# EAGLE design Resistor_Phantom (EAGLE 7.2.0)
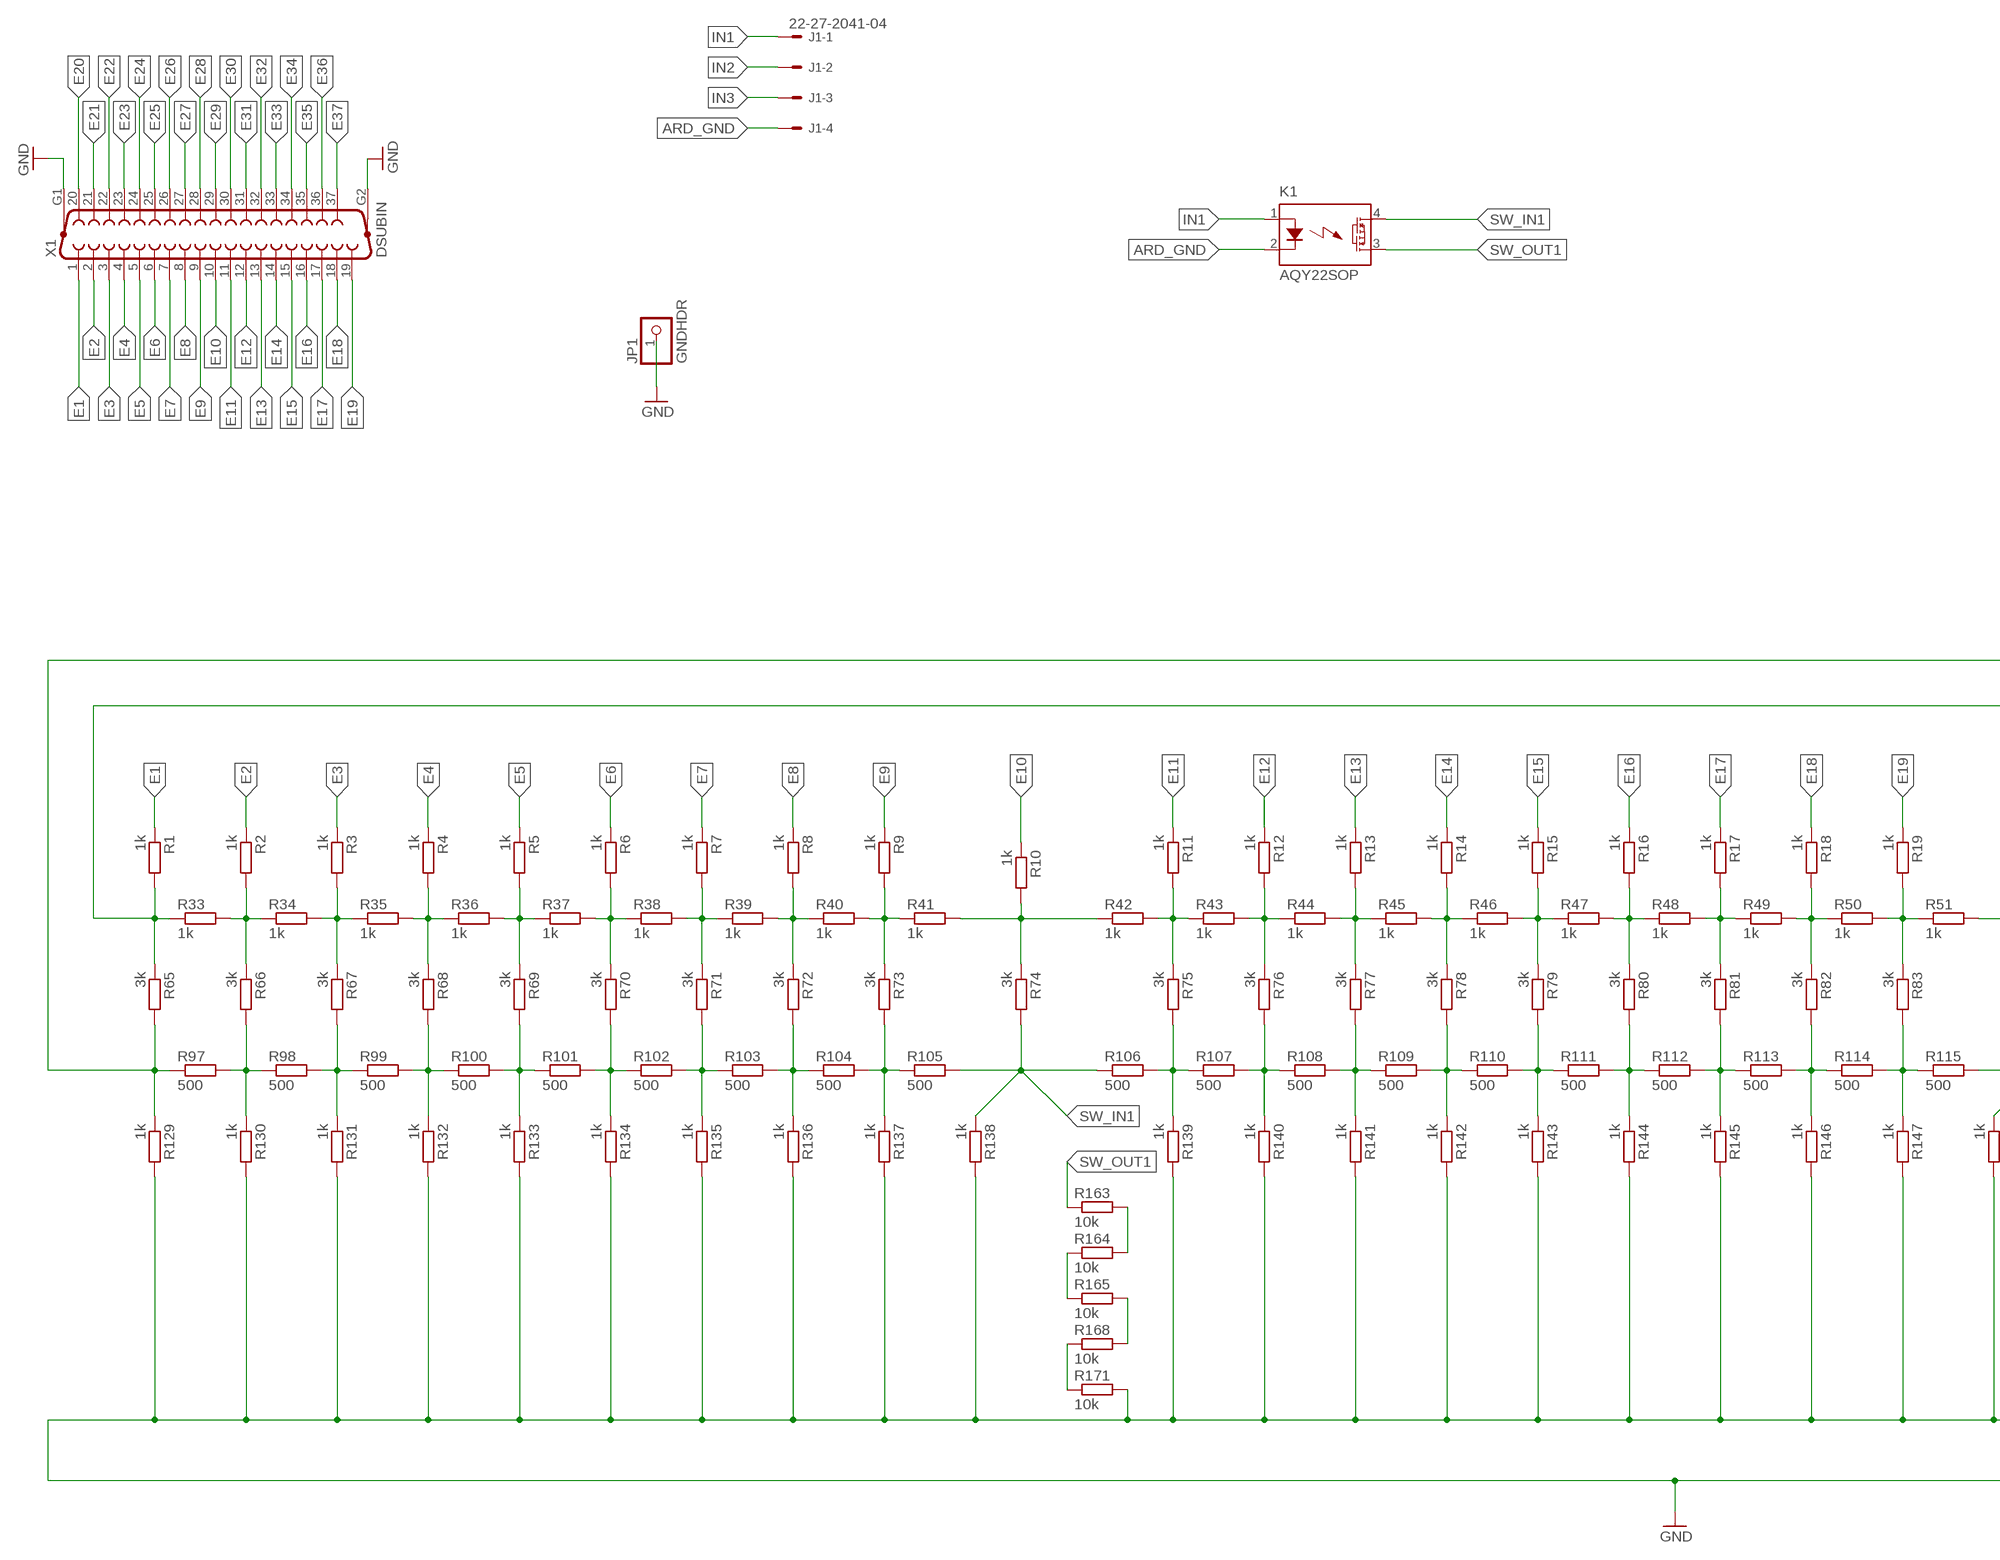
[diagram p0: schematic, sheet 1, part 1 of 2]
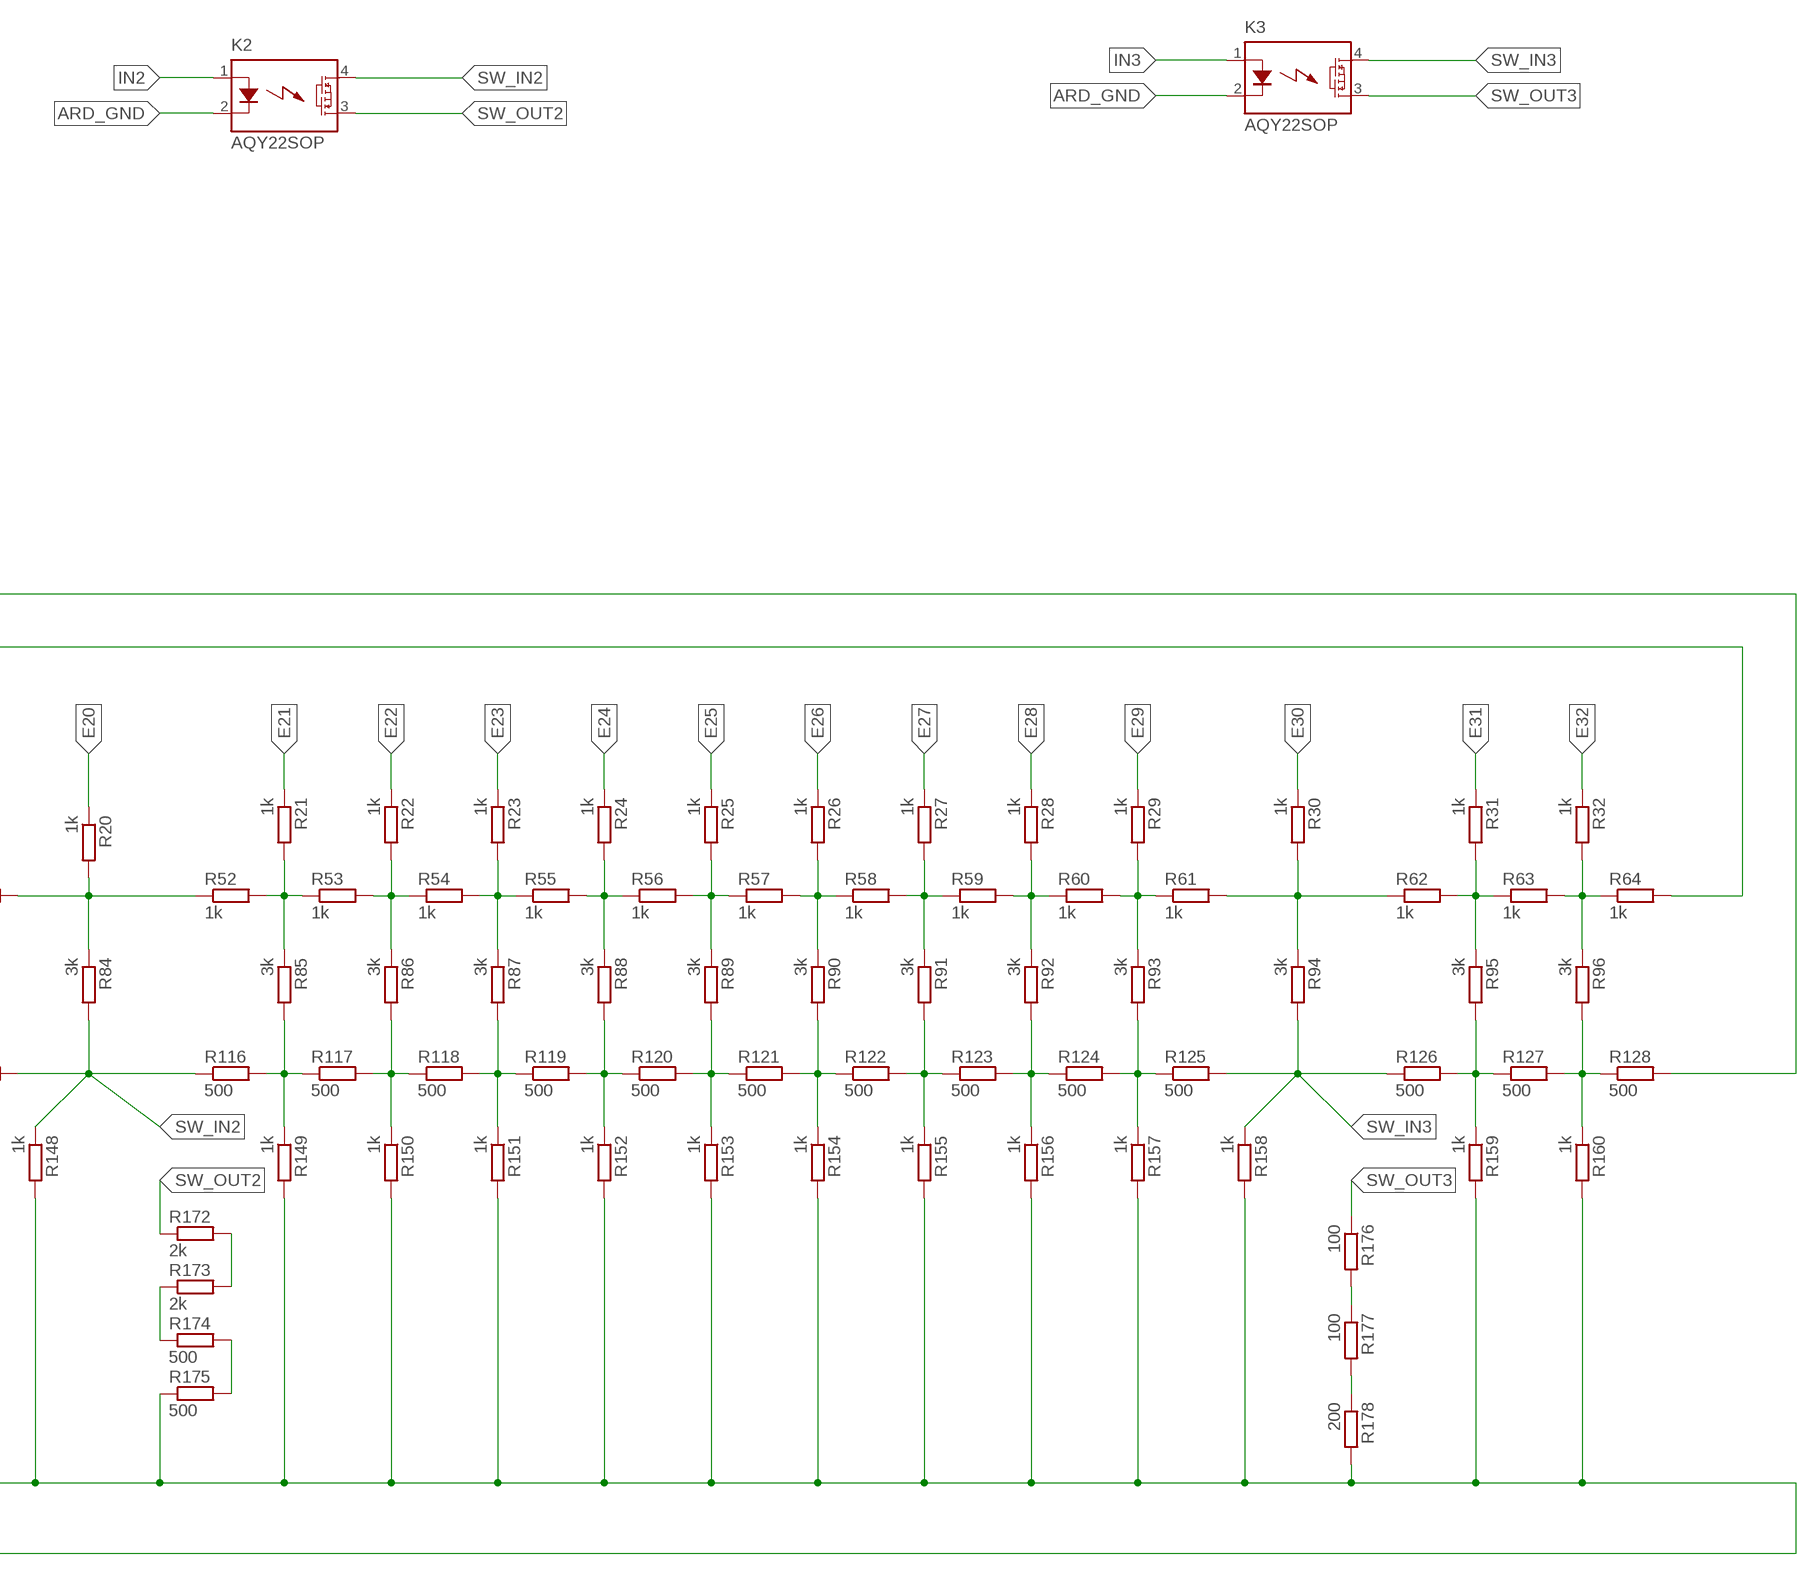
[diagram p1: schematic, sheet 1, part 2 of 2]

## Parts
J1  22-27-2041-04  [6410-04]
JP1  GNDHDR  PINHD-1X1  [1X01]
K1  AQY22SOP  [SOP04]
K2  AQY22SOP  [SOP04]
K3  AQY22SOP  [SOP04]
R1  1k  R-EU_R0402  [R0402]
R2  1k  R-EU_R0402  [R0402]
R3  1k  R-EU_R0402  [R0402]
R4  1k  R-EU_R0402  [R0402]
R5  1k  R-EU_R0402  [R0402]
R6  1k  R-EU_R0402  [R0402]
R7  1k  R-EU_R0402  [R0402]
R8  1k  R-EU_R0402  [R0402]
R9  1k  R-EU_R0402  [R0402]
R10  1k  R-EU_R0402  [R0402]
R11  1k  R-EU_R0402  [R0402]
R12  1k  R-EU_R0402  [R0402]
R13  1k  R-EU_R0402  [R0402]
R14  1k  R-EU_R0402  [R0402]
R15  1k  R-EU_R0402  [R0402]
R16  1k  R-EU_R0402  [R0402]
R17  1k  R-EU_R0402  [R0402]
R18  1k  R-EU_R0402  [R0402]
R19  1k  R-EU_R0402  [R0402]
R20  1k  R-EU_R0402  [R0402]
R21  1k  R-EU_R0402  [R0402]
R22  1k  R-EU_R0402  [R0402]
R23  1k  R-EU_R0402  [R0402]
R24  1k  R-EU_R0402  [R0402]
R25  1k  R-EU_R0402  [R0402]
R26  1k  R-EU_R0402  [R0402]
R27  1k  R-EU_R0402  [R0402]
R28  1k  R-EU_R0402  [R0402]
R29  1k  R-EU_R0402  [R0402]
R30  1k  R-EU_R0402  [R0402]
R31  1k  R-EU_R0402  [R0402]
R32  1k  R-EU_R0402  [R0402]
R33  1k  R-EU_R0402  [R0402]
R34  1k  R-EU_R0402  [R0402]
R35  1k  R-EU_R0402  [R0402]
R36  1k  R-EU_R0402  [R0402]
R37  1k  R-EU_R0402  [R0402]
R38  1k  R-EU_R0402  [R0402]
R39  1k  R-EU_R0402  [R0402]
R40  1k  R-EU_R0402  [R0402]
R41  1k  R-EU_R0402  [R0402]
R42  1k  R-EU_R0402  [R0402]
R43  1k  R-EU_R0402  [R0402]
R44  1k  R-EU_R0402  [R0402]
R45  1k  R-EU_R0402  [R0402]
R46  1k  R-EU_R0402  [R0402]
R47  1k  R-EU_R0402  [R0402]
R48  1k  R-EU_R0402  [R0402]
R49  1k  R-EU_R0402  [R0402]
R50  1k  R-EU_R0402  [R0402]
R51  1k  R-EU_R0402  [R0402]
R52  1k  R-EU_R0402  [R0402]
R53  1k  R-EU_R0402  [R0402]
R54  1k  R-EU_R0402  [R0402]
R55  1k  R-EU_R0402  [R0402]
R56  1k  R-EU_R0402  [R0402]
R57  1k  R-EU_R0402  [R0402]
R58  1k  R-EU_R0402  [R0402]
R59  1k  R-EU_R0402  [R0402]
R60  1k  R-EU_R0402  [R0402]
R61  1k  R-EU_R0402  [R0402]
R62  1k  R-EU_R0402  [R0402]
R63  1k  R-EU_R0402  [R0402]
R64  1k  R-EU_R0402  [R0402]
R65  3k  R-EU_R0402  [R0402]
R66  3k  R-EU_R0402  [R0402]
R67  3k  R-EU_R0402  [R0402]
R68  3k  R-EU_R0402  [R0402]
R69  3k  R-EU_R0402  [R0402]
R70  3k  R-EU_R0402  [R0402]
R71  3k  R-EU_R0402  [R0402]
R72  3k  R-EU_R0402  [R0402]
R73  3k  R-EU_R0402  [R0402]
R74  3k  R-EU_R0402  [R0402]
R75  3k  R-EU_R0402  [R0402]
R76  3k  R-EU_R0402  [R0402]
R77  3k  R-EU_R0402  [R0402]
R78  3k  R-EU_R0402  [R0402]
R79  3k  R-EU_R0402  [R0402]
R80  3k  R-EU_R0402  [R0402]
R81  3k  R-EU_R0402  [R0402]
R82  3k  R-EU_R0402  [R0402]
R83  3k  R-EU_R0402  [R0402]
R84  3k  R-EU_R0402  [R0402]
R85  3k  R-EU_R0402  [R0402]
R86  3k  R-EU_R0402  [R0402]
R87  3k  R-EU_R0402  [R0402]
R88  3k  R-EU_R0402  [R0402]
R89  3k  R-EU_R0402  [R0402]
R90  3k  R-EU_R0402  [R0402]
R91  3k  R-EU_R0402  [R0402]
R92  3k  R-EU_R0402  [R0402]
R93  3k  R-EU_R0402  [R0402]
R94  3k  R-EU_R0402  [R0402]
R95  3k  R-EU_R0402  [R0402]
R96  3k  R-EU_R0402  [R0402]
R97  500  R-EU_R0402  [R0402]
R98  500  R-EU_R0402  [R0402]
R99  500  R-EU_R0402  [R0402]
R100  500  R-EU_R0402  [R0402]
R101  500  R-EU_R0402  [R0402]
R102  500  R-EU_R0402  [R0402]
R103  500  R-EU_R0402  [R0402]
R104  500  R-EU_R0402  [R0402]
R105  500  R-EU_R0402  [R0402]
R106  500  R-EU_R0402  [R0402]
R107  500  R-EU_R0402  [R0402]
R108  500  R-EU_R0402  [R0402]
R109  500  R-EU_R0402  [R0402]
R110  500  R-EU_R0402  [R0402]
R111  500  R-EU_R0402  [R0402]
R112  500  R-EU_R0402  [R0402]
R113  500  R-EU_R0402  [R0402]
R114  500  R-EU_R0402  [R0402]
R115  500  R-EU_R0402  [R0402]
R116  500  R-EU_R0402  [R0402]
R117  500  R-EU_R0402  [R0402]
R118  500  R-EU_R0402  [R0402]
R119  500  R-EU_R0402  [R0402]
R120  500  R-EU_R0402  [R0402]
R121  500  R-EU_R0402  [R0402]
R122  500  R-EU_R0402  [R0402]
R123  500  R-EU_R0402  [R0402]
R124  500  R-EU_R0402  [R0402]
R125  500  R-EU_R0402  [R0402]
R126  500  R-EU_R0402  [R0402]
R127  500  R-EU_R0402  [R0402]
R128  500  R-EU_R0402  [R0402]
R129  1k  R-EU_R0402  [R0402]
R130  1k  R-EU_R0402  [R0402]
R131  1k  R-EU_R0402  [R0402]
R132  1k  R-EU_R0402  [R0402]
R133  1k  R-EU_R0402  [R0402]
R134  1k  R-EU_R0402  [R0402]
R135  1k  R-EU_R0402  [R0402]
R136  1k  R-EU_R0402  [R0402]
R137  1k  R-EU_R0402  [R0402]
R138  1k  R-EU_R0402  [R0402]
R139  1k  R-EU_R0402  [R0402]
R140  1k  R-EU_R0402  [R0402]
R141  1k  R-EU_R0402  [R0402]
R142  1k  R-EU_R0402  [R0402]
R143  1k  R-EU_R0402  [R0402]
R144  1k  R-EU_R0402  [R0402]
R145  1k  R-EU_R0402  [R0402]
R146  1k  R-EU_R0402  [R0402]
R147  1k  R-EU_R0402  [R0402]
R148  1k  R-EU_R0402  [R0402]
R149  1k  R-EU_R0402  [R0402]
R150  1k  R-EU_R0402  [R0402]
R151  1k  R-EU_R0402  [R0402]
R152  1k  R-EU_R0402  [R0402]
R153  1k  R-EU_R0402  [R0402]
R154  1k  R-EU_R0402  [R0402]
R155  1k  R-EU_R0402  [R0402]
R156  1k  R-EU_R0402  [R0402]
R157  1k  R-EU_R0402  [R0402]
R158  1k  R-EU_R0402  [R0402]
R159  1k  R-EU_R0402  [R0402]
R160  1k  R-EU_R0402  [R0402]
R163  10k  R-EU_R0402  [R0402]
R164  10k  R-EU_R0402  [R0402]
R165  10k  R-EU_R0402  [R0402]
R168  10k  R-EU_R0402  [R0402]
R171  10k  R-EU_R0402  [R0402]
R172  2k  R-EU_R0402  [R0402]
R173  2k  R-EU_R0402  [R0402]
R174  500  R-EU_R0402  [R0402]
R175  500  R-EU_R0402  [R0402]
R176  100  R-EU_R0402  [R0402]
R177  100  R-EU_R0402  [R0402]
R178  200  R-EU_R0402  [R0402]
X1  DSUBIN  F37VP  [F37VP]

## Nets
ARD_GND: J1.4 K1.2(K) K2.2(K) K3.2(K)
E1: R1.1 X1.1
E2: R2.1 X1.2
E3: R3.1 X1.3
E4: R4.1 X1.4
E5: R5.1 X1.5
E6: R6.1 X1.6
E7: R7.1 X1.7
E8: R8.1 X1.8
E9: R9.1 X1.9
E10: R10.1 X1.10
E11: R11.1 X1.11
E12: R12.1 X1.12
E13: R13.1 X1.13
E14: R14.1 X1.14
E15: R15.1 X1.15
E16: R16.1 X1.16
E17: R17.1 X1.17
E18: R18.1 X1.18
E19: R19.1 X1.19
E20: R20.1 X1.20
E21: R21.1 X1.21
E22: R22.1 X1.22
E23: R23.1 X1.23
E24: R24.1 X1.24
E25: R25.1 X1.25
E26: R26.1 X1.26
E27: R27.1 X1.27
E28: R28.1 X1.28
E29: R29.1 X1.29
E30: R30.1 X1.30
E31: R31.1 X1.31
E32: R32.1 X1.32
E33: X1.33
E34: X1.34
E35: X1.35
E36: X1.36
E37: X1.37
E38: R1.2 R33.1 R64.2 R65.1
E39: R2.2 R33.2 R34.1 R66.1
E40: R3.2 R34.2 R35.1 R67.1
E41: R4.2 R35.2 R36.1 R68.1
E42: R5.2 R36.2 R37.1 R69.1
E43: R6.2 R37.2 R38.1 R70.1
E44: R7.2 R38.2 R39.1 R71.1
E45: R8.2 R39.2 R40.1 R72.1
E46: R9.2 R40.2 R41.1 R73.1
E47: R10.2 R41.2 R42.1 R74.1
E48: R11.2 R42.2 R43.1 R75.1
E49: R12.2 R43.2 R44.1 R76.1
E50: R13.2 R44.2 R45.1 R77.1
E51: R14.2 R45.2 R46.1 R78.1
E52: R15.2 R46.2 R47.1 R79.1
E53: R16.2 R47.2 R48.1 R80.1
E54: R17.2 R48.2 R49.1 R81.1
E55: R18.2 R49.2 R50.1 R82.1
E56: R19.2 R50.2 R51.1 R83.1
E57: R20.2 R51.2 R52.1 R84.1
E58: R21.2 R52.2 R53.1 R85.1
E59: R22.2 R53.2 R54.1 R86.1
E60: R23.2 R54.2 R55.1 R87.1
E61: R24.2 R55.2 R56.1 R88.1
E63: R26.2 R57.2 R58.1 R90.1
E64: R27.2 R58.2 R59.1 R91.1
E65: R28.2 R59.2 R60.1 R92.1
E66: R29.2 R60.2 R61.1 R93.1
E67: R30.2 R61.2 R62.1 R94.1
E68: R31.2 R62.2 R63.1 R95.1
E69: R32.2 R63.2 R64.1 R96.1
GND: JP1.1 R129.2 R130.2 R131.2 R132.2 R133.2 R134.2 R135.2 R136.2 R137.2 R138.2 R139.2 R140.2 R141.2 R142.2 R143.2 R144.2 R145.2 R146.2 R147.2 R148.2 R149.2 R150.2 R151.2 R152.2 R153.2 R154.2 R155.2 R156.2 R157.2 R158.2 R159.2 R160.2 R171.2 R175.1 R178.2 X1.G1 X1.G2
IN1: J1.1 K1.1(A)
IN2: J1.2 K2.1(A)
IN3: J1.3 K3.1(A)
N$1: R25.2 R56.2 R57.1 R89.1
N$2: R65.2 R97.1 R128.2 R129.1
N$3: R66.2 R97.2 R98.1 R130.1
N$4: R67.2 R98.2 R99.1 R131.1
N$5: R68.2 R99.2 R100.1 R132.1
N$6: R69.2 R100.2 R101.1 R133.1
N$7: R70.2 R101.2 R102.1 R134.1
N$8: R71.2 R102.2 R103.1 R135.1
N$9: R72.2 R103.2 R104.1 R136.1
N$10: R73.2 R104.2 R105.1 R137.1
N$12: R75.2 R106.2 R107.1 R139.1
N$13: R76.2 R107.2 R108.1 R140.1
N$14: R77.2 R108.2 R109.1 R141.1
N$15: R78.2 R109.2 R110.1 R142.1
N$16: R79.2 R110.2 R111.1 R143.1
N$17: R80.2 R111.2 R112.1 R144.1
N$18: R81.2 R112.2 R113.1 R145.1
N$19: R82.2 R113.2 R114.1 R146.1
N$20: R83.2 R114.2 R115.1 R147.1
N$22: R85.2 R116.2 R117.1 R149.1
N$23: R86.2 R117.2 R118.1 R150.1
N$24: R87.2 R118.2 R119.1 R151.1
N$25: R88.2 R119.2 R120.1 R152.1
N$26: R89.2 R120.2 R121.1 R153.1
N$28: R90.2 R121.2 R122.1 R154.1
N$29: R91.2 R122.2 R123.1 R155.1
N$30: R92.2 R123.2 R124.1 R156.1
N$31: R93.2 R124.2 R125.1 R157.1
N$33: R95.2 R126.2 R127.1 R159.1
N$34: R96.2 R127.2 R128.1 R160.1
N$41: R163.2 R164.2
N$42: R164.1 R165.1
N$43: R165.2 R168.2
N$44: R168.1 R171.1
N$45: R172.2 R173.2
N$46: R173.1 R174.1
N$47: R174.2 R175.2
N$48: R176.2 R177.1
N$49: R177.2 R178.1
SW_IN1: K1.4(DS1) R74.2 R105.2 R106.1 R138.1
SW_IN2: K2.4(DS1) R84.2 R115.2 R116.1 R148.1
SW_IN3: K3.4(DS1) R94.2 R125.2 R126.1 R158.1
SW_OUT1: K1.3(DS2) R163.1
SW_OUT2: K2.3(DS2) R172.1
SW_OUT3: K3.3(DS2) R176.1

## Library data of the parts
J1 = con-molex:22-?-04: CONNECTOR wire to board 2.54 mm (.1 inch) pitch header; OC_FARNELL: unknown; OC_NEWARK: unknown
JP1 = pinhead:PINHD-1X1: PIN HEADER
K1-K3 = relay:AQY*: PhotoMOS Relay NAiS Source: http://www.panasonic-electric-works.com/catalogues/downloads/photomos/ds_x615_en_aqz10_20.pdf; OC_FARNELL: unknown; OC_NEWARK: unknown
R1-R160 R163-R165 R168 R171-R178 = rcl:R-EU_: RESISTOR, European symbol
X1 = con-subd:F37VP: SUB-D; OC_FARNELL: unknown; OC_NEWARK: unknown

## Board
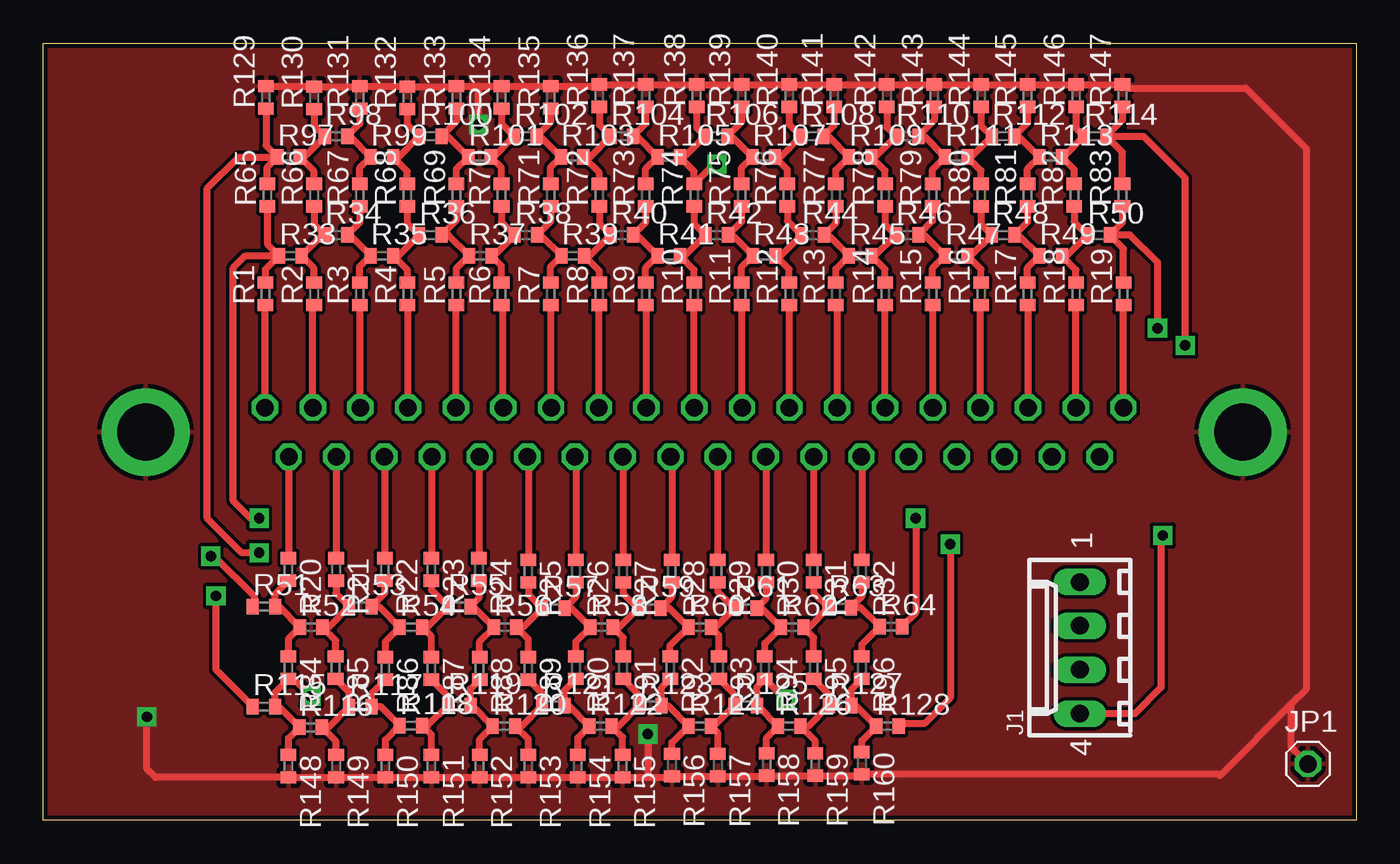
[diagram p2: board, top side]
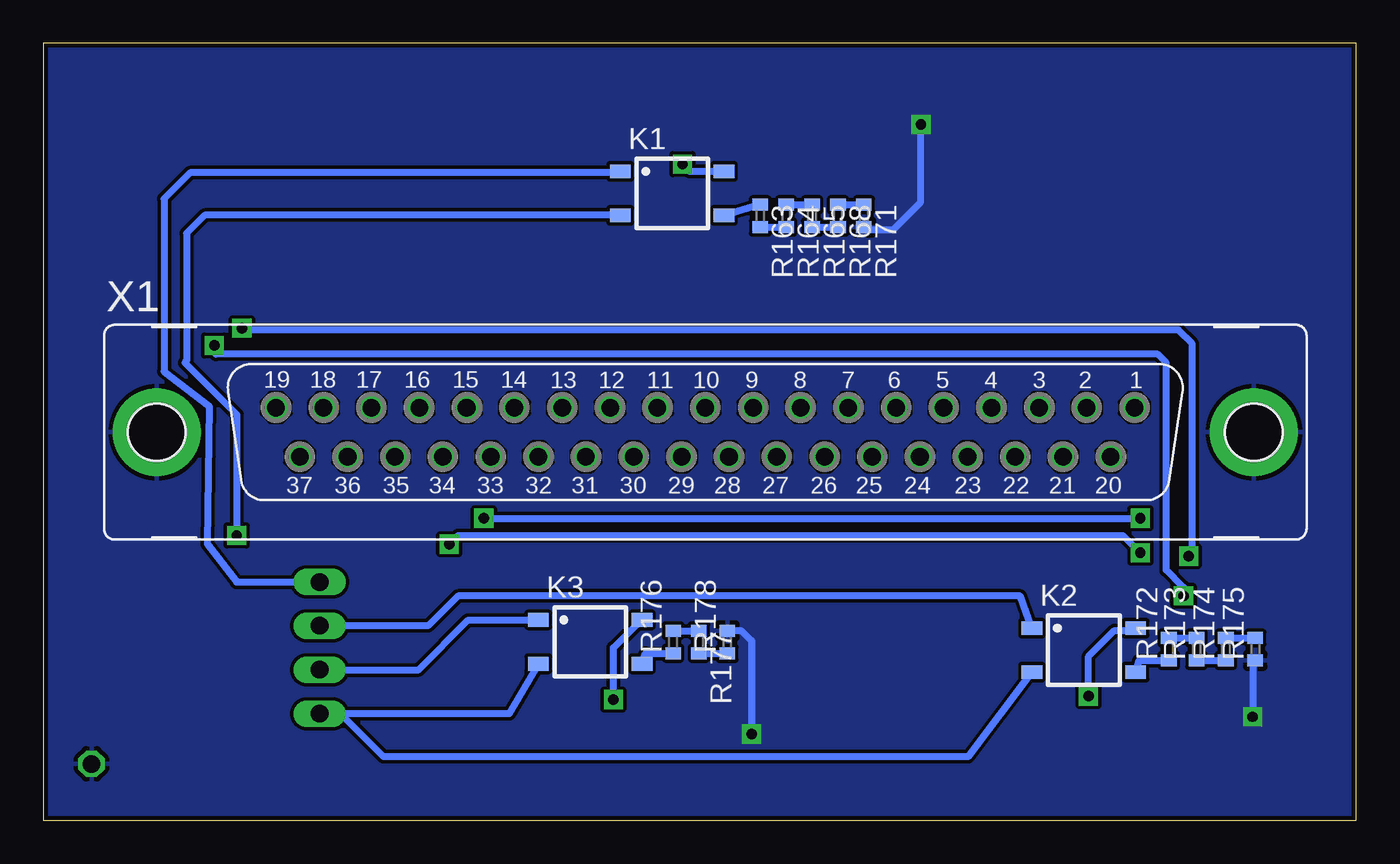
[diagram p3: board, bottom side, seen from below]

Size 76 x 45 mm. Coordinates in mm from the lower left corner, seen from the top.
Outline: 0,45 76,45 76,0 0,0 0,45
Copper layers (1*16): Top 0.035mm / dielectric 1.5mm / Bottom 0.035mm
Design rules "pcbtrain": minimum track width 0.2mm, minimum drill 0.4mm, track to track 0.2mm, track to pad 0.2mm, pad to pad 0.2mm, via to via 0.2mm, smd to smd 0mil, copper to edge 10mil, drill to drill 0.2mm, minimum pad ring 10mil, minimum via ring 10mil, stop-mask expansion 0.125mm, vias tented up to drill 0mil, thermal gap 10mil

### Footprints (pad centres in the part's own frame; a part is rotated, then mirrored left to right if it is on the bottom)
6410-04 = drill 1.016 long: 1 3.81,0; 2 1.27,0; 3 -1.27,0; 4 -3.81,0
1X01 = drill 1.016 octagon: 1 0,0
SOP04 = smd 0.8 x 1.2: 1 -1.27,-3; 2 1.27,-3; 3 1.27,3; 4 -1.27,3
R0402 = smd 0.7 x 0.9: 1 -0.65,0; 2 0.65,0
F37VP = drill 1.016 octagon: 1 24.841,1.422; 2 22.073,1.422; 3 19.329,1.422; 4 16.561,1.422; 5 13.792,1.422; 6 11.049,1.422; 7 8.28,1.422; 8 5.512,1.422; 9 2.769,1.422; 10 0,1.422; 11 -2.769,1.422; 12 -5.512,1.422; 13 -8.28,1.422; 14 -11.049,1.422; 15 -13.818,1.422; 16 -16.561,1.422; 17 -19.329,1.422; 18 -22.098,1.422; 19 -24.841,1.422; 20 23.47,-1.422; 21 20.701,-1.422; 22 17.932,-1.422; 23 15.189,-1.422; 24 12.421,-1.422; 25 9.652,-1.422; 26 6.909,-1.422; 27 4.14,-1.422; 28 1.372,-1.422; 29 -1.372,-1.422; 30 -4.14,-1.422; 31 -6.909,-1.422; 32 -9.677,-1.422; 33 -12.421,-1.422; 34 -15.189,-1.422; 35 -17.958,-1.422; 36 -20.701,-1.422; 37 -23.47,-1.422 | drill 3.302 pad 5.08: G1 -31.75,0; G2 31.75,0

### Placement (x,y rotation side)
J1  60,10 90 top
JP1  73.21,3.28 0 top
K1  39.6,36.31 270 bottom
K2  15.77,9.87 270 bottom
K3  44.34,10.35 270 bottom
R1  12.87,30.5 90 top
R2  15.68,30.5 90 top
R3  18.33,30.5 90 top
R4  21.09,30.5 90 top
R5  23.92,30.48 90 top
R6  26.53,30.48 90 top
R7  29.38,30.48 90 top
R8  32.19,30.48 90 top
R9  34.87,30.48 90 top
R10  37.68,30.48 90 top
R11  40.42,30.48 90 top
R12  43.17,30.48 90 top
R13  45.88,30.48 90 top
R14  48.73,30.48 90 top
R15  51.47,30.48 90 top
R16  54.28,30.48 90 top
R17  56.97,30.48 90 top
R18  59.78,30.48 90 top
R19  62.52,30.48 90 top
R20  14.2,14.54 270 top
R21  16.95,14.54 270 top
R22  19.77,14.54 270 top
R23  22.47,14.54 270 top
R24  25.22,14.54 270 top
R25  28.08,14.44 270 top
R26  30.83,14.44 270 top
R27  33.56,14.44 270 top
R28  36.38,14.44 270 top
R29  39.04,14.44 270 top
R30  41.83,14.44 270 top
R31  44.59,14.44 270 top
R32  47.38,14.44 270 top
R33  14.31,32.69 0 top
R34  16.95,33.89 0 top
R35  19.6,32.69 0 top
R36  22.41,33.89 0 top
R37  25.29,32.69 0 top
R38  27.94,33.89 0 top
R39  30.65,32.69 0 top
R40  33.5,33.89 0 top
R41  36.21,32.69 0 top
R42  38.99,33.89 0 top
R43  41.73,32.69 0 top
R44  44.54,33.89 0 top
R45  47.29,32.69 0 top
R46  50,33.89 0 top
R47  52.85,32.69 0 top
R48  55.56,33.89 0 top
R49  58.3,32.69 0 top
R50  61.09,33.89 0 top
R51  12.78,12.39 0 top
R52  15.51,11.19 0 top
R53  18.36,12.39 0 top
R54  21.28,11.19 0 top
R55  24.08,12.39 0 top
R56  26.73,11.19 0 top
R57  29.52,12.29 0 top
R58  32.32,11.19 0 top
R59  35.07,12.29 0 top
R60  37.99,11.19 0 top
R61  40.65,12.29 0 top
R62  43.34,11.19 0 top
R63  46.1,12.33 0 top
R64  49.06,11.23 0 top
R65  12.97,36.2 90 top
R66  15.68,36.2 90 top
R67  18.33,36.2 90 top
R68  21.07,36.2 90 top
R69  23.92,36.2 90 top
R70  26.53,36.2 90 top
R71  29.38,36.2 90 top
R72  32.19,36.2 90 top
R73  34.87,36.2 90 top
R74  37.68,36.2 90 top
R75  40.42,36.2 90 top
R76  43.07,36.2 90 top
R77  45.88,36.2 90 top
R78  48.73,36.2 90 top
R79  51.47,36.2 90 top
R80  54.28,36.2 90 top
R81  56.97,36.2 90 top
R82  59.68,36.2 90 top
R83  62.46,36.2 90 top
R84  14.2,8.84 270 top
R85  16.93,8.84 270 top
R86  19.81,8.81 270 top
R87  22.47,8.81 270 top
R88  25.26,8.81 270 top
R89  28.08,8.81 270 top
R90  30.83,8.84 270 top
R91  33.56,8.84 270 top
R92  36.29,8.84 270 top
R93  39.11,8.84 270 top
R94  41.77,8.84 270 top
R95  44.59,8.84 270 top
R96  47.38,8.84 270 top
R97  14.21,38.41 0 top
R98  16.95,39.61 0 top
R99  19.6,38.41 0 top
R100  22.41,39.61 0 top
R101  25.26,38.41 0 top
R102  27.9,39.61 0 top
R103  30.61,38.41 0 top
R104  33.5,39.61 0 top
R105  36.21,38.41 0 top
R106  38.95,39.61 0 top
R107  41.7,38.41 0 top
R108  44.51,39.61 0 top
R109  47.29,38.41 0 top
R110  50,39.61 0 top
R111  52.85,38.41 0 top
R112  55.56,39.61 0 top
R113  58.3,38.41 0 top
R114  60.89,39.61 0 top
R115  12.78,6.6 0 top
R116  15.48,5.4 0 top
R117  18.36,6.6 0 top
R118  21.28,5.5 0 top
R119  24.08,6.66 0 top
R120  26.67,5.46 0 top
R121  29.52,6.66 0 top
R122  32.25,5.46 0 top
R123  35.15,6.66 0 top
R124  38,5.46 0 top
R125  40.66,6.66 0 top
R126  43.18,5.46 0 top
R127  46.13,6.66 0 top
R128  48.86,5.46 0 top
R129  12.9,41.86 90 top
R130  15.68,41.82 90 top
R131  18.33,41.86 90 top
R132  21.07,41.82 90 top
R133  23.92,41.86 90 top
R134  26.53,41.86 90 top
R135  29.38,41.86 90 top
R136  32.19,41.96 90 top
R137  34.87,41.96 90 top
R138  37.81,41.96 90 top
R139  40.42,41.96 90 top
R140  43.17,41.96 90 top
R141  45.78,41.96 90 top
R142  48.83,41.96 90 top
R143  51.57,41.96 90 top
R144  54.28,41.96 90 top
R145  56.97,41.96 90 top
R146  59.78,41.96 90 top
R147  62.46,41.96 90 top
R148  14.2,3.15 270 top
R149  16.95,3.15 270 top
R150  19.81,3.15 270 top
R151  22.47,3.15 270 top
R152  25.26,3.15 270 top
R153  28.08,3.15 270 top
R154  30.94,3.15 270 top
R155  33.54,3.15 270 top
R156  36.39,3.21 270 top
R157  39.05,3.21 270 top
R158  41.87,3.25 270 top
R159  44.69,3.25 270 top
R160  47.38,3.31 270 top
R163  34.5,35 270 bottom
R164  33,35 270 bottom
R165  31.5,35 270 bottom
R168  30,35 270 bottom
R171  28.5,35 270 bottom
R172  10.85,9.92 90 bottom
R173  9.25,9.92 90 bottom
R174  7.55,9.92 90 bottom
R175  5.85,9.92 90 bottom
R176  39.55,10.34 90 bottom
R177  38.05,10.34 270 bottom
R178  36.41,10.33 90 bottom
X1  37.68,22.48 0 bottom

### Tracks (layer width: path | path; a pad name or v marks a point on that pad's centre or on a via)
ARD_GND  (via drill 0.6)
  Top 0.406: v64.8,16.5 64.7,16.4 64.7,7.7 63.19,6.19 J1.4
  Bottom 0.406: K3.2 49.04,6.19 J1.4 58.79,6.19 56.3,3.7 22.48,3.7 K2.2 | v64.8,16.5 64.8,23.5 67.8,26.5 67.7,26.6 67.7,34 66.66,35.03 K1.2
E1
  Top 0.406: X1.1 12.84,29.82 R1.1
E2
  Top 0.406: X1.2 15.61,29.78 R2.1
E3
  Top 0.406: X1.3 18.35,29.83 R3.1
E4
  Top 0.406: X1.4 21.12,29.82 R4.1
E5
  Top 0.406: X1.5 23.89,29.8 R5.1
E6
  Top 0.406: X1.6 26.63,29.73 R6.1
E7
  Top 0.406: X1.7 29.4,29.81 R7.1
E8
  Top 0.406: X1.8 32.17,29.82 R8.1
E9
  Top 0.406: X1.9 34.91,29.79 R9.1
E10
  Top 0.406: X1.10 R10.1
E11
  Top 0.406: X1.11 40.45,29.81 R11.1
E12
  Top 0.406: X1.12 43.19,29.82 R12.1
E13
  Top 0.406: X1.13 45.96,29.76 R13.1
E14
  Top 0.406: X1.14 R14.1
E15
  Top 0.406: X1.15 51.5,29.81 R15.1
E16
  Top 0.406: X1.16 54.24,29.79 R16.1
E17
  Top 0.406: X1.17 57.01,29.79 R17.1
E18
  Top 0.406: X1.18 R18.1
E19
  Top 0.406: X1.19 R19.1
E20
  Top 0.406: X1.20 14.2,21.05 R20.1
E21
  Top 0.406: X1.21 16.95,21.04 R21.1
E22
  Top 0.406: X1.22 19.77,21.03 R22.1
E23
  Top 0.406: X1.23 22.47,21.04 R23.1
E24
  Top 0.406: X1.24 25.22,21.02 R24.1
E25
  Top 0.406: X1.25 28.08,21.01 R25.1
E26
  Top 0.406: X1.26 30.83,20.99 R26.1
E27
  Top 0.406: X1.27 33.56,21.03 R27.1
E28
  Top 0.406: X1.28 36.38,20.98 R28.1
E29
  Top 0.406: X1.29 39.04,21.05 R29.1
E30
  Top 0.406: X1.30 41.83,21.05 R30.1
E31
  Top 0.406: X1.31 R31.1
E32
  Top 0.406: X1.32 47.38,21.03 R32.1
E38  (via drill 0.6)
  Top 0.406: v12.5,17.5 12,17.5 11,18.5 11,32 11.7,32.7 R33.1 | R1.2 12.87,31.91 R33.1 | R65.1 12.97,33.38 R33.1 | v50.5,17.5 50.5,12.01 R64.2
  Bottom 0.406: v50.5,17.5 v12.5,17.5
E39
  Top 0.406: R2.2 15.68,31.97 R33.2 16.16,33.89 R34.1 15.68,34.52 R66.1
E40
  Top 0.406: R3.2 18.33,32.07 R35.1 17.75,33.89 R34.2 18.33,34.62 R67.1
E41
  Top 0.406: R4.2 21.09,31.86 R35.2 20.56,32.69 R36.1 21.07,34.58 R68.1
E42
  Top 0.406: R5.2 23.92,31.97 R37.1 23.44,33.89 R36.2 23.92,34.75 R69.1
E43
  Top 0.406: R6.2 26.53,32.11 R37.2 26.09,32.69 R38.1 26.53,34.65 R70.1
E44
  Top 0.406: R7.2 29.38,32.07 R39.1 28.8,33.89 R38.2 29.38,34.68 R71.1
E45
  Top 0.406: R8.2 32.19,31.81 R39.2 31.64,32.69 R40.1 32.19,34.55 R72.1
E46
  Top 0.406: R9.2 34.87,32.01 R41.1 34.35,33.89 R40.2 34.87,34.62 R73.1
E47
  Top 0.406: R10.2 37.68,31.87 R41.2 37.14,32.69 R42.1 37.68,34.55 R74.1
E48
  Top 0.406: R11.2 40.42,32.03 R43.1 39.88,33.89 R42.2 40.42,34.68 R75.1
E49
  Top 0.406: R12.2 43.17,31.91 R43.2 42.69,32.69 R44.1 43.07,34.72 R76.1
E50
  Top 0.406: R13.2 45.88,31.94 R45.1 45.44,33.89 R44.2 45.88,34.58 R77.1
E51
  Top 0.406: R14.2 48.73,31.91 R45.2 48.15,32.69 R46.1 48.73,34.52 R78.1
E52
  Top 0.406: R15.2 51.47,31.97 R47.1 51,33.89 R46.2 51.47,34.72 R79.1
E53
  Top 0.406: R16.2 54.28,31.91 R47.2 53.71,32.69 R48.1 54.28,34.52 R80.1
E54
  Top 0.406: R17.2 56.97,32.01 R49.1 56.45,33.89 R48.2 56.97,34.65 R81.1
E55
  Top 0.406: R18.2 59.78,31.87 R49.2 59.24,32.69 R50.1 59.68,34.65 R82.1
E56  (via drill 0.6)
  Top 0.406: v64.5,28.5 64.5,32.3 62.9,33.9 R50.2 | R83.1 62.46,34.62 R50.2 | R19.2 62.52,33.11 R50.2 | v9.7,15.3 9.9,15.3 12.2,13 12.2,12.46 R51.1
  Bottom 0.406: v9.7,15.3 9.5,15.5 9.5,27.6 10.3,28.4 64.4,28.4 v64.5,28.5
E57
  Top 0.406: R20.2 13.43,13.12 R51.2 13.66,12.39 R52.1 14.2,10.53 R84.1
E58
  Top 0.406: R21.2 16.95,13.15 R53.1 16.51,11.19 R52.2 16.93,10.42 R85.1
E59
  Top 0.406: R22.2 19.77,13.15 R53.2 19.43,12.39 R54.1 19.81,10.37 R86.1
E60
  Top 0.406: R23.2 22.47,13.35 R55.1 22.23,11.19 R54.2 22.47,10.66 R87.1
E61
  Top 0.406: R24.2 25.22,12.89 R55.2 24.88,12.39 R56.1 25.26,10.37 R88.1
E63
  Top 0.406: R26.2 30.83,12.95 R57.2 30.57,12.29 R58.1 30.83,10.36 R90.1
E64
  Top 0.406: R27.2 33.56,13.15 R59.1 33.32,11.19 R58.2 33.56,10.59 R91.1
E65
  Top 0.406: R28.2 36.38,12.95 R59.2 36.24,12.29 R60.1 36.29,10.14 R92.1
E66
  Top 0.406: R29.2 39.04,13.25 R61.1 38.9,11.19 R60.2 39.11,10.72 R93.1
E67
  Top 0.406: R30.2 41.83,12.82 R61.2 41.59,12.29 R62.1 41.77,10.27 R94.1
E68
  Top 0.406: R31.2 44.59,13.19 R63.1 44.31,11.19 R62.2 44.59,10.59 R95.1
E69
  Top 0.406: R32.2 47.38,12.96 R63.2 47.31,12.33 R64.1 47.38,10.19 R96.1
GND  (via drill 0.6)
  Top 0.406: R129.2 15.64,42.51 R130.2 18.29,42.47 R131.2 21.04,42.51 R132.2 23.88,42.47 R133.2 25.2,42.51 | 25.2,42.51 R134.2 R135.2 32.09,42.51 R136.2 R137.2 R138.2 R139.2 R140.2 R141.2 R142.2 R143.2 R144.2 R145.2 R146.2 R147.2 62.67,42.4 69.6,42.4 73.1,38.9 73.1,7.6 72.25,6.75 | 35,2.5 R155.2 R154.2 R153.2 R152.2 R151.2 R150.2 R149.2 R148.2 6.5,2.5 6,3 v6,6 | 35,2.5 36.33,2.5 R156.2 R157.2 41.83,2.56 R158.2 R159.2 47.32,2.6 R160.2 68.04,2.66 68.1,2.6 72.25,6.75 | v35,5 35,2.5 | v25.2,40.3 25.2,42.51 | JP1.1 72.25,4.23 72.25,6.75
  Bottom 0.406: v35,5 35,10.4 35.58,10.98 R178.2 | R171.2 28.35,34.2 26.8,34.2 25.2,35.8 v25.2,40.3 | R175.1 6,9.12 v6,6
  pour Top: -3,45 79,45 79,0 -3,0
  pour Bottom: -4,46 80,46 80,-1 -4,-1
IN1
  Bottom 0.406: J1.1 64.81,13.81 66.5,16 66.4,24 69,26 69,36 67.5,37.5 42.67,37.5 K1.1
IN2
  Bottom 0.406: K2.1 19.44,13 52,13 53.73,11.27 J1.2
IN3
  Bottom 0.406: J1.3 54.27,8.73 51.4,11.6 47.36,11.6 K3.1
N$1
  Top 0.406: R25.2 28.08,13.09 R57.1 27.78,11.19 R56.2 28.08,10.49 R89.1
N$2  (via drill 0.6)
  Top 0.406: v12.5,15.5 11.5,15.5 9.5,17.5 9.5,36.6 11.3,38.4 13.54,38.4 R97.1 | R65.2 12.97,37.83 R97.1 | R129.1 12.9,39.07 R97.1 | v52.5,16 52.5,7.1 51,5.6 49.65,5.6 R128.2
  Bottom 0.406: v52.5,16 52,16.5 13.5,16.5 v12.5,15.5
N$3
  Top 0.406: R66.2 15.68,37.59 R97.2 15.1,38.41 R98.1 15.68,40.24 R130.1
N$4
  Top 0.406: R67.2 18.33,37.79 R99.1 17.75,39.61 R98.2 18.33,40.34 R131.1
N$5
  Top 0.406: R68.2 21.07,37.59 R99.2 20.56,38.41 R100.1 21.07,40.3 R132.1
N$6
  Top 0.406: R69.2 23.92,37.73 R101.1 23.41,39.61 R100.2 23.92,40.47 R133.1
N$7
  Top 0.406: R70.2 26.53,37.79 R101.2 26.05,38.41 R102.1 26.53,40.34 R134.1
N$8
  Top 0.406: R71.2 29.38,37.83 R103.1 28.76,39.61 R102.2 29.38,40.44 R135.1
N$9
  Top 0.406: R72.2 32.19,37.49 R103.2 31.64,38.41 R104.1 32.19,40.27 R136.1
N$10
  Top 0.406: R73.2 34.87,37.73 R105.1 34.35,39.61 R104.2 34.87,40.34 R137.1
N$12
  Top 0.406: R75.2 40.42,37.79 R107.1 39.85,39.61 R106.2 40.42,40.44 R139.1
N$13
  Top 0.406: R76.2 43.07,37.69 R107.2 42.66,38.41 R108.1 43.17,40.3 R140.1
N$14
  Top 0.406: R77.2 45.88,37.65 R109.1 45.44,39.61 R108.2 45.78,40.24 R141.1
N$15
  Top 0.406: R78.2 48.73,37.63 R109.2 48.15,38.41 R110.1 48.83,40.14 R142.1
N$16
  Top 0.406: R79.2 51.47,37.69 R111.1 51,39.61 R110.2 51.57,40.54 R143.1
N$17
  Top 0.406: R80.2 54.28,37.63 R111.2 53.71,38.41 R112.1 54.28,40.24 R144.1
N$18
  Top 0.406: R81.2 56.97,37.73 R113.1 56.45,39.61 R112.2 56.97,40.37 R145.1
N$19
  Top 0.406: R82.2 59.68,37.69 R113.2 59.04,38.41 R114.1 59.78,40.07 R146.1
N$20  (via drill 0.6)
  Top 0.406: v10,13 10,8.73 R115.1 | R83.2 62.46,38.69 R114.2 | R147.1 62.46,40.54 R114.2 | v66.1,27.5 66.1,37.2 63.7,39.6 R114.2
  Bottom 0.406: v10,13 10,13.5 11,14.5 11,26.5 11.5,27 66,27 v66.1,27.5
N$22
  Top 0.406: R85.2 17.71,7.41 R117.1 16.51,5.4 R116.2 16.95,4.57 R149.1
N$23
  Top 0.406: R86.2 19.01,7.36 R117.2 19.53,6.6 R118.1 19.81,4.67 R150.1
N$24
  Top 0.406: R87.2 23.43,7.2 R119.1 22.26,5.5 R118.2 22.47,4.96 R151.1
N$25
  Top 0.406: R88.2 24.73,7.62 R119.2 24.82,6.66 R120.1 25.26,4.7 R152.1
N$26
  Top 0.406: R89.2 28.88,7.36 R121.1 27.67,5.46 R120.2 28.08,4.7 R153.1
N$28
  Top 0.406: R90.2 30.17,7.53 R121.2 30.4,6.66 R122.1 30.94,4.8 R154.1
N$29
  Top 0.406: R91.2 34.5,7.26 R123.1 33.3,5.46 R122.2 33.54,4.83 R155.1
N$30
  Top 0.406: R92.2 35.8,7.7 R123.2 36.15,6.66 R124.1 36.39,4.5 R156.1
N$31
  Top 0.406: R93.2 40.01,7.3 R125.1 38.81,5.46 R124.2 39.05,5.06 R157.1
N$33
  Top 0.406: R95.2 45.48,7.3 R127.1 44.28,5.46 R126.2 44.69,4.6 R159.1
N$34
  Top 0.406: R96.2 46.78,7.6 R127.2 47.01,6.66 R128.1 47.38,4.63 R160.1
N$41
  Bottom 0.406: R163.2 R164.2
N$42
  Bottom 0.406: R164.1 R165.1
N$43
  Bottom 0.406: R165.2 R168.2
N$44
  Bottom 0.406: R168.1 R171.1
N$45
  Bottom 0.406: R172.2 R173.2
N$46
  Bottom 0.406: R173.1 R174.1
N$47
  Bottom 0.406: R174.2 R175.2
N$48
  Bottom 0.406: R176.2 R177.1
N$49
  Bottom 0.406: R177.2 38.04,9.68 R178.1
SW_IN1  (via drill 0.6)
  Top 0.406: R138.1 37.81,40.1 R106.1 37.1,38.41 R105.2 37.68,37.59 R74.2 38.82,38 v39,38
  Bottom 0.406: K1.4 38.58,37.58 v39,38
SW_IN2  (via drill 0.6)
  Top 0.406: R148.1 14.2,4.76 R116.1 13.63,6.6 R115.2 13.43,7.42 R84.2 14.51,8.19 v15.5,7.2
  Bottom 0.406: v15.5,7.2 15.5,9.5 14,11 12.91,11 K2.4
SW_IN3  (via drill 0.6)
  Top 0.406: R158.1 41.87,4.8 R126.1 41.33,6.66 R125.2 41.31,7.73 R94.2 42.96,7 v43,7
  Bottom 0.406: v43,7 43,10 42.02,10.98 K3.4
SW_OUT1
  Bottom 0.406: K1.3 34.52,35.67 R163.1
SW_OUT2
  Bottom 0.406: K2.3 12.56,9.27 R172.1
SW_OUT3
  Bottom 0.406: K3.3 41.14,9.69 R176.1

### Text on the board
tText: Gnd | 0.1% | (ch 10) | 1.0% | (ch 20) | 10% | (ch 30) | Ard Gnd | Fast Neural Phantom | Gnd